# EAGLE schematic Schematic (EAGLE 9.7.0)
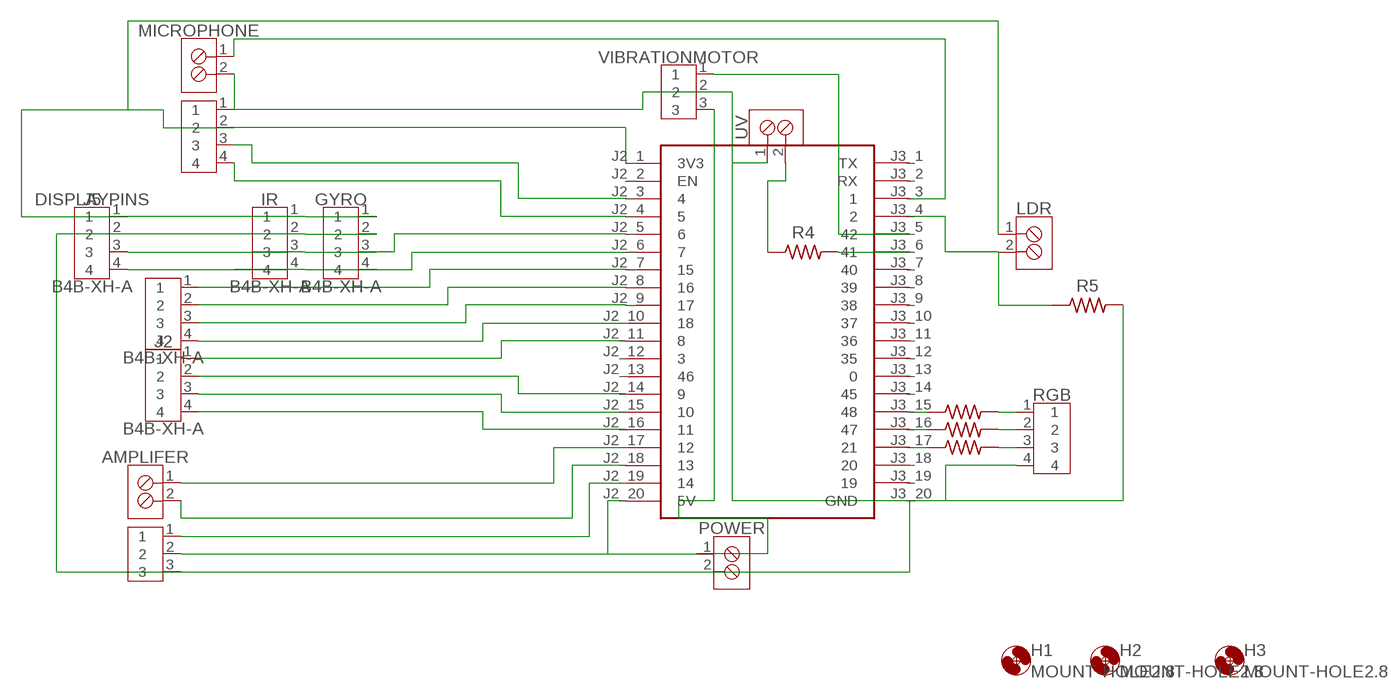
[diagram p0: schematic, sheet 1]

## Parts
AMPLIFER  B2B-XH-A  [B2B-XH-A]
DISPLAYPINS  B4B-XH-A  [B4B-XH-A]
GYRO  B4B-XH-A  [B4B-XH-A]
H1  MOUNT-HOLE2.8  [2,8]
H2  MOUNT-HOLE2.8  [2,8]
H3  MOUNT-HOLE2.8  [2,8]
IR  B4B-XH-A  [B4B-XH-A]
J1  B4B-XH-A  [B4B-XH-A]
J2  B4B-XH-A  [B4B-XH-A]
J4  B3B-XH-A  [B3B-XH-A]
J5  B4B-XH-A  [B4B-XH-A]
LDR  B2B-XH-A  [B2B-XH-A]
MICROPHONE  B2B-XH-A  [B2B-XH-A]
POWER  B2B-XH-A  [B2B-XH-A]
R1  RESISTOR_AXIAL-11.7MM-PITCH  [RESAD1176W63L850D250B]
R2  RESISTOR_AXIAL-11.7MM-PITCH  [RESAD1176W63L850D250B]
R3  RESISTOR_AXIAL-11.7MM-PITCH  [RESAD1176W63L850D250B]
R4  RESISTOR_AXIAL-11.7MM-PITCH  [RESAD1176W63L850D250B]
R5  RESISTOR_AXIAL-11.7MM-PITCH  [RESAD1176W63L850D250B]
RGB  B4B-XH-A  [B4B-XH-A]
U2  ESP32-DEVKITC-32E  [MODULE_ESP32-DEVKITC-32E]
UV  B2B-XH-A  [B2B-XH-A]
VIBRATIONMOTOR  B3B-XH-A  [B3B-XH-A]

## Nets
N$1: U2.J3_5 VIBRATIONMOTOR.1
N$2: J2.2 U2.J2_14
N$3: DISPLAYPINS.1 U2.J2_7
N$4: DISPLAYPINS.2 U2.J2_8
N$5: DISPLAYPINS.3 U2.J2_9
N$6: DISPLAYPINS.4 U2.J2_10
N$7: J2.1 U2.J2_11
N$8: J1.3 U2.J2_3
N$9: J1.4 U2.J2_4
N$10: J4.1 U2.J2_19
N$11: J2.3 U2.J2_15
N$12: J2.4 U2.J2_16
N$13: AMPLIFER.2 U2.J2_18
N$14: AMPLIFER.1 U2.J2_17
N$15: R1.1 U2.J3_15
N$16: R2.1 U2.J3_16
N$17: R3.1 U2.J3_17
N$18: R1.2 RGB.1
N$19: R2.2 RGB.2
N$20: R3.2 RGB.3
N$21: J4.2 POWER.1 U2.J2_20(5V) VIBRATIONMOTOR.3
N$22: R4.1 UV.2
N$23: GYRO.1 IR.1 J1.2 J5.1 U2.J2_1(3V3)
N$24: LDR.2 R5.1 U2.J3_4
N$25: J5.4
N$26: GYRO.3 IR.3 U2.J2_5
N$27: MICROPHONE.1 U2.J3_3
N$28: GYRO.4 IR.4 U2.J2_6
N$29: LDR.1
N$30: J5.3
N$31: GYRO.2 IR.2 J1.1 J4.3 J5.2 MICROPHONE.2 POWER.2 R5.2 RGB.4 U2.J3_20(GND) VIBRATIONMOTOR.2
N$32: UV.1
N$33: R4.2 U2.J3_6
Unconnected: U2.J2_2(EN) U2.J2_12 U2.J2_13 U2.J3_2(RX) U2.J3_8 U2.J3_9 U2.J3_10 U2.J3_11 U2.J3_12 U2.J3_13 U2.J3_14 U2.J3_18 U2.J3_19

## Power pins joined to a net without a drawn wire
40: U2.J3_7
TX: U2.J3_1(TX)

## Library data of the parts
AMPLIFER LDR MICROPHONE POWER UV = Connector:B2B-XH-A: XH Connector Top Entry - 2POS Details see: Datasheet <http://www.jst-mfg.com/product/pdf/eng/eXH.pdf>
DISPLAYPINS GYRO IR J1 J2 J5 RGB = Connector:B4B-XH-A: XH Connector Top Entry - 4POS Details see: Datasheet <http://www.jst-mfg.com/product/pdf/eng/eXH.pdf>
H1-H3 = SEMET+1:MOUNT-HOLE: MOUNTING HOLE with drill center marker
J4 VIBRATIONMOTOR = Connector:B3B-XH-A: XH Connector Top Entry - 3POS Details see: Datasheet <http://www.jst-mfg.com/product/pdf/eng/eXH.pdf>
R1-R5 = SEMET+1:RESISTOR: Resistor Fixed - ANSI
U2 = freenove esp32 s3:ESP32-DEVKITC-32E